# EAGLE schematic Transitest556-170113 (EAGLE 6.4)
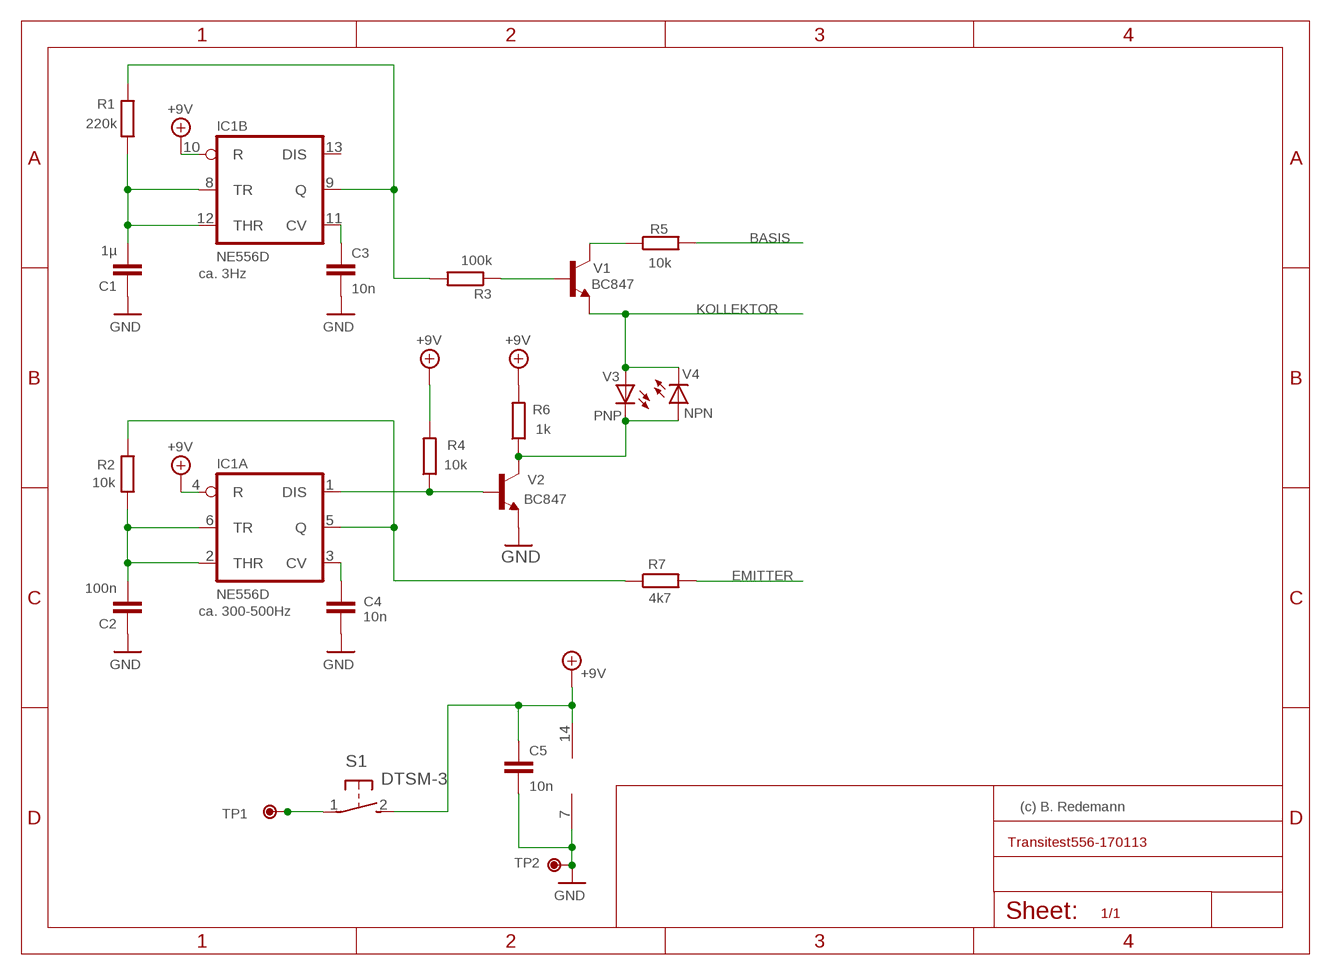
[diagram p0: schematic, sheet 1]

## Parts
C1  1µ  C-EUC0805  [C0805]
C2  100n  C-EUC0805  [C0805]
C3  10n  C-EUC0805  [C0805]
C4  10n  C-EUC0805  [C0805]
C5  10n  C-EUC0805  [C0805]
IC1  NE556D  [SO14]
R1  220k  R-EU_R0805  [R0805]
R2  10k  R-EU_R0805  [R0805]
R3  100k  R-EU_R0805  [R0805]
R4  10k  R-EU_R0805  [R0805]
R5  10k  R-EU_R0805  [R0805]
R6  1k  R-EU_R0805  [R0805]
R7  4k7  R-EU_R0805  [R0805]
S1  DTSM-3  [DTSM-3]
TP1  TPPAD1-13  [P1-13]
TP2  TPPAD1-13  [P1-13]
V1  BC847  [SOT23]
V2  BC847  [SOT23]
V3  PNP  LEDCHIP-LED0805  [CHIP-LED0805]
V4  NPN  LEDCHIP-LED0805  [CHIP-LED0805]

## Nets
+9V: C5.1 IC1.4(A:R) IC1.10(B:R) IC1.14(P:V+) R4.2 R6.2 S1.2
BASIS: R5.2
EMITTER: R7.2
GND: C1.1 C2.1 C3.2 C4.1 C5.2 IC1.7(P:GND) TP2.TP V2.2(E)
KOLLEKTOR: V1.2(E) V3.A V4.C
N$1: IC1.1(A:DIS) R4.1 V2.1(B)
N$2: C4.2 IC1.3(A:CV)
N$3: R5.1 V1.3(C)
N$4: R6.1 V2.3(C) V3.C V4.A
N$5: IC1.5(A:Q) R2.2 R7.1
N$7: IC1.9(B:Q) R1.2 R3.2
N$8: C3.1 IC1.11(B:CV)
N$13: S1.1 TP1.TP
N$16: C2.2 IC1.2(A:THR) IC1.6(A:TR) R2.1
N$17: R3.1 V1.1(B)
N$18: C1.2 IC1.8(B:TR) IC1.12(B:THR) R1.1
Unconnected: IC1.13(B:DIS)

## Notes on the sheet
- ca. 3Hz
- ca. 300-500Hz
- (c) B. Redemann

## Library data of the parts
C1-C5 = resistor:C-EU: CAPACITOR, European symbol
IC1 = linear:*556: Dual TIMER
R1-R7 = resistor:R-EU_: RESISTOR, European symbol
S1 = switch-tact:DTSM-3
TP1 TP2 = testpad:TP: Test pad
V1 V2 = transistor:BC847: NPN TRANSISTOR
V3 V4 = led:LED: LED OSRAM: - CHIPLED LG R971, LG N971, LY N971, LG Q971, LY Q971, LO R971, LY R971 LH N974, LH R974 LS Q976, LO Q976, LY Q976 LO Q996 - Hyper CHIPLED LW Q18S LB Q993, LB Q99A, LB R99A - SideLED LS A670, LO A670, LY A670, LG A670, LP A670 LB A673, LV A673, LT A673, LW A673 LH A674 LY A675 LS A676, LA A676, LO A676, LY A676, LW A676 LS A679, LY A679, LG A679 - Hyper Micro SIDELED® LS Y876, LA Y876, LO Y876, LY Y876 LT Y87S - SmartLED LW L88C, LW L88S LB L89C, LB L89S, LG L890 LS L89K, LO L89K, LY L89K LS L896, LA L896, LO L896, LY L896 - TOPLED LS T670, LO T670, LY T670, LG T670, LP T670 LSG T670, LSP T670, LSY T670, LOP T670, LYG T670 LG T671, LOG T671, LSG T671 LB T673, LV T673, LT T673, LW T673 LH T674 LS T676, LA T676, LO T676, LY T676, LB T676, LH T676, LSB T676, LW T676 LB T67C, LV T67C, LT T67C, LS T67K, LO T67K, LY T67K, LW E67C LS E67B, LA E67B, LO E67B, LY E67B, LB E67C, LV E67C, LT E67C LW T67C LS T679, LY T679, LG T679 LS T770, LO T770, LY T770, LG T770, LP T770 LB T773, LV T773, LT T773, LW T773 LH T774 LS E675, LA E675, LY E675, LS T675 LS T776, LA T776, LO T776, LY T776, LB T776 LHGB T686 LT T68C, LB T68C - Hyper Mini TOPLED® LB M676 - Mini TOPLED Santana® LG M470 LS M47K, LO M47K, LY M47K Source: http://www.osram.convergy.de LUXEON: - LUMILED® LXK2-PW12-R00, LXK2-PW12-S00, LXK2-PW14-U00, LXK2-PW14-V00 LXK2-PM12-R00, LXK2-PM12-S00, LXK2-PM14-U00 LXK2-PE12-Q00, LXK2-PE12-R00, LXK2-PE12-S00, LXK2-PE14-T00, LXK2-PE14-U00 LXK2-PB12-K00, LXK2-PB12-L00, LXK2-PB12-M00, LXK2-PB14-N00, LXK2-PB14-P00, LXK2-PB14-Q00 LXK2-PR12-L00, LXK2-PR12-M00, LXK2-PR14-Q00, LXK2-PR14-R00 LXK2-PD12-Q00, LXK2-PD12-R00, LXK2-PD12-S00 LXK2-PH12-R00, LXK2-PH12-S00 LXK2-PL12-P00, LXK2-PL12-Q00, LXK2-PL12-R00 Source: www.luxeon.com KINGBRIGHT: KA-3528ASYC Source: www.kingbright.com